# Altium schematic sheet CC430.SchDoc
size A
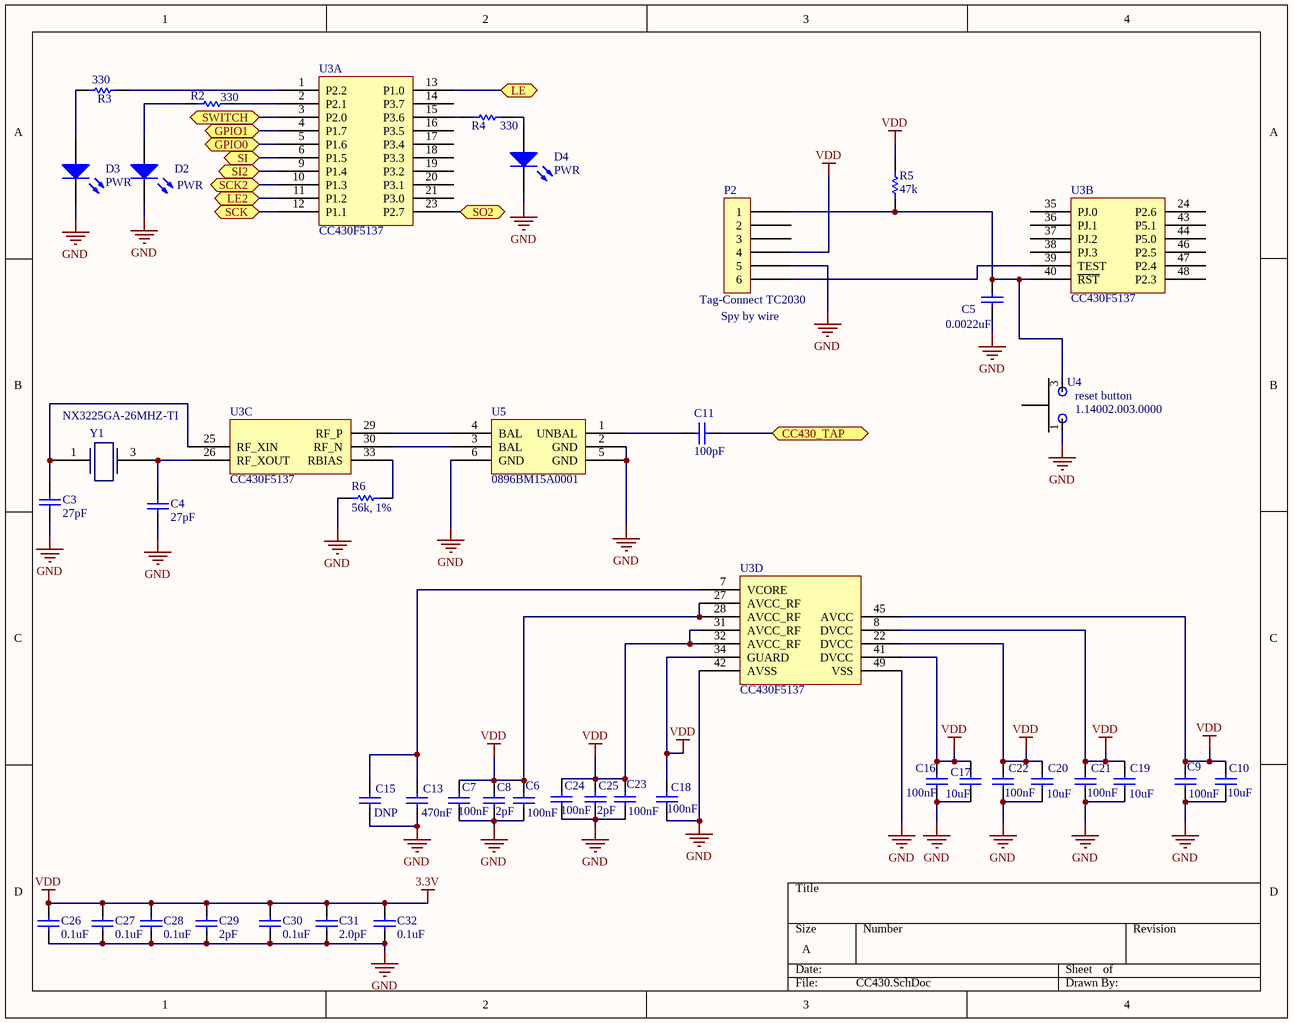
[diagram p0: CC430.SchDoc]

## Parts
C3  value 27pF  [0402]  (hidden comment: Cap Semi)
C4  value 27pF  [0402]  (hidden comment: Cap Semi)
C5  value 0.0022uF  [0402]  (hidden comment: Cap Semi)
C6  value 100nF  [0402]  (hidden comment: Cap Semi)
C7  value 100nF  [0402]  (hidden comment: Cap Semi)
C8  value 2pF  [0402]  (hidden comment: Cap Semi)
C9  value 100nF  [0402]  (hidden comment: Cap Semi)
C10  value 10uF  [0402]  (hidden comment: Cap Semi)
C11  value 100pF  [0402]  (hidden comment: Cap Semi)
C13  value 470nF  [0402]  (hidden comment: Cap Semi)
C15  value DNP  [0402]  (hidden comment: Cap Semi)
C16  value 100nF  [0402]  (hidden comment: Cap Semi)
C17  value 10uF  [0402]  (hidden comment: Cap Semi)
C18  value 100nF  [0402]  (hidden comment: Cap Semi)
C19  value 10uF  [0402]  (hidden comment: Cap Semi)
C20  value 10uF  [0402]  (hidden comment: Cap Semi)
C21  value 100nF  [0402]  (hidden comment: Cap Semi)
C22  value 100nF  [0402]  (hidden comment: Cap Semi)
C23  value 100nF  [0402]  (hidden comment: Cap Semi)
C24  value 100nF  [0402]  (hidden comment: Cap Semi)
C25  value 2pF  [0402]  (hidden comment: Cap Semi)
C26  value 0.1uF  [0402]  (hidden comment: Cap Semi)
C27  value 0.1uF  [0402]  (hidden comment: Cap Semi)
C28  value 0.1uF  [0402]  (hidden comment: Cap Semi)
C29  value 2pF  [0402]  (hidden comment: Cap Semi)
C30  value 0.1uF  [0402]  (hidden comment: Cap Semi)
C31  value 2.0pF  [0402]  (hidden comment: Cap Semi)
C32  value 0.1uF  [0402]  (hidden comment: Cap Semi)
D2  PWR  [0603]
D3  PWR  [0603]
D4  PWR  [0603]
P2  Tag-Connect TC2030
R2  value 330  [0402]  (hidden comment: Res Semi)
R3  value 330  [0402]  (hidden comment: Res Semi)
R4  value 330  [0402]  (hidden comment: Res Semi)
R5  value 47k  [0402]  (hidden comment: Res Semi)
R6  value 56k, 1%  [0402]  (hidden comment: Res Semi)
U3  CC430F5137  (parts A,B,C,D of 4)
U4  reset button
U5  0896BM15A0001
Y1  NX3225GA-26MHZ-TI

## Ports
CC430_TAP, GPIO0, GPIO1, LE, LE2, SCK, SCK2, SI, SI2, SO2, SWITCH

## Nets
3.3V: C6.1 C7.1 C8.1 C9.1 C10.1 C16.1 C17.1 C18.1 C19.1 C20.1 C21.1 C22.1 C23.1 C24.1 C25.1 C26.1 C27.1 C28.1 C29.1 C30.1 C31.1 C32.1 P2.?4(4) R5.1 U3.8(DVCC) U3.22(DVCC) U3.27(AVCC_RF) U3.28(AVCC_RF) U3.31(AVCC_RF) U3.32(AVCC_RF) U3.34(GUARD) U3.41(DVCC) U3.45(AVCC)  [also labelled VDD]
GND: C3.2 C4.2 C5.2 C6.2 C7.2 C8.2 C9.2 C10.2 C13.2 C15.2 C16.2 C17.2 C18.2 C19.2 C20.2 C21.2 C22.2 C23.2 C24.2 C25.2 C26.2 C27.2 C28.2 C29.2 C30.2 C31.2 C32.2 D2.2(K) D3.2(K) D4.2(K) P2.?5(5) R6.1 U3.42(AVSS) U3.49(VSS) U4.1 U5.2(GND) U5.5(GND) U5.6(GND)
CC430_TAP: C11.1 ; port CC430_TAP
GPIO0: U3.5(P1.6) ; port GPIO0
GPIO1: U3.4(P1.7) ; port GPIO1
LE: U3.13(P1.0) ; port LE
LE2: U3.11(P1.2) ; port LE2
SCK: U3.12(P1.1) ; port SCK
SCK2: U3.10(P1.3) ; port SCK2
SI: U3.6(P1.5) ; port SI
SI2: U3.9(P1.4) ; port SI2
SO2: U3.23(P2.7) ; port SO2
SWITCH: U3.3(P2.0) ; port SWITCH
NetC3_1: C3.1 U3.25(RF_XIN) Y1.1
NetC4_1: C4.1 U3.26(RF_XOUT) Y1.3
NetC5_1: C5.1 P2.?1(1) R5.2 U3.40(~{RST}) U4.3
NetC11_2: C11.2 U5.1(UNBAL)
NetC13_1: C13.1 C15.1 U3.7(VCORE)
NetD2_1: D2.1(A) R2.2
NetD3_1: D3.1(A) R3.2
NetD4_1: D4.1(A) R4.1
NetP2_?6: P2.?6(6) U3.39(TEST)
NetR2_1: R2.1 U3.2(P2.1)
NetR3_1: R3.1 U3.1(P2.2)
NetR4_2: R4.2 U3.15(P3.6)
NetR6_2: R6.2 U3.33(RBIAS)
NetU3_29: U3.29(RF_P) U5.4(BAL)
NetU3_30: U3.30(RF_N) U5.3(BAL)

Not connected (* = marked no-connect by the designer): P2 ?2(2) ?3(3); U3 14(P3.7) 16(P3.5) 17(P3.4) 18(P3.3) 19(P3.2) 20(P3.1) 21(P3.0) 24(P2.6) 35(PJ.0) 36(PJ.1) 37(PJ.2) 38(PJ.3) 43(P5.1) 44(P5.0) 46(P2.5) 47(P2.4) 48(P2.3)

## Notes on the sheet
- (near P2) Spy by wire
- (near U4) 1.14002.003.0000

## Library data of the parts
C3-C11 C13 C15-C32 = Cap Semi: Capacitor (Semiconductor SIM Model); Published: 8-Jun-2000; LatestRevisionDate: 29-May-2009; LatestRevisionNote: IPC-7351 Footprint Added.; PackageReference: C1206; Publisher: Altium Limited; PackageDescription: Chip Capacitor
D2-D4 = LED2: Typical RED, GREEN, YELLOW, AMBER GaAs LED; Published: 8-Jun-2000; LatestRevisionDate: 17-Jul-2002; LatestRevisionNote: Re-released for DXP Platform.; PackageVersion: Feb-2002; PackageReference: 3.2X1.6X1.1; Publisher: Altium Limited; PackageDescription: SM LED; 2 Flat Leads
P2 = tag-connect
R2-R6 = Res Semi: Semiconductor Resistor; Published: 8-Jun-2000; LatestRevisionDate: 17-Jul-2002; LatestRevisionNote: Re-released for DXP Platform.; PackageReference: AXIAL-0.5; Publisher: Altium Limited; PackageDescription: Axial Device, Thru-Hole; 2 Leads; 0.5 in Pin Spacing
U5 = 0896BM15A0001: Balun